# Altium schematic sheet SCH_UC.SchDoc
size A4
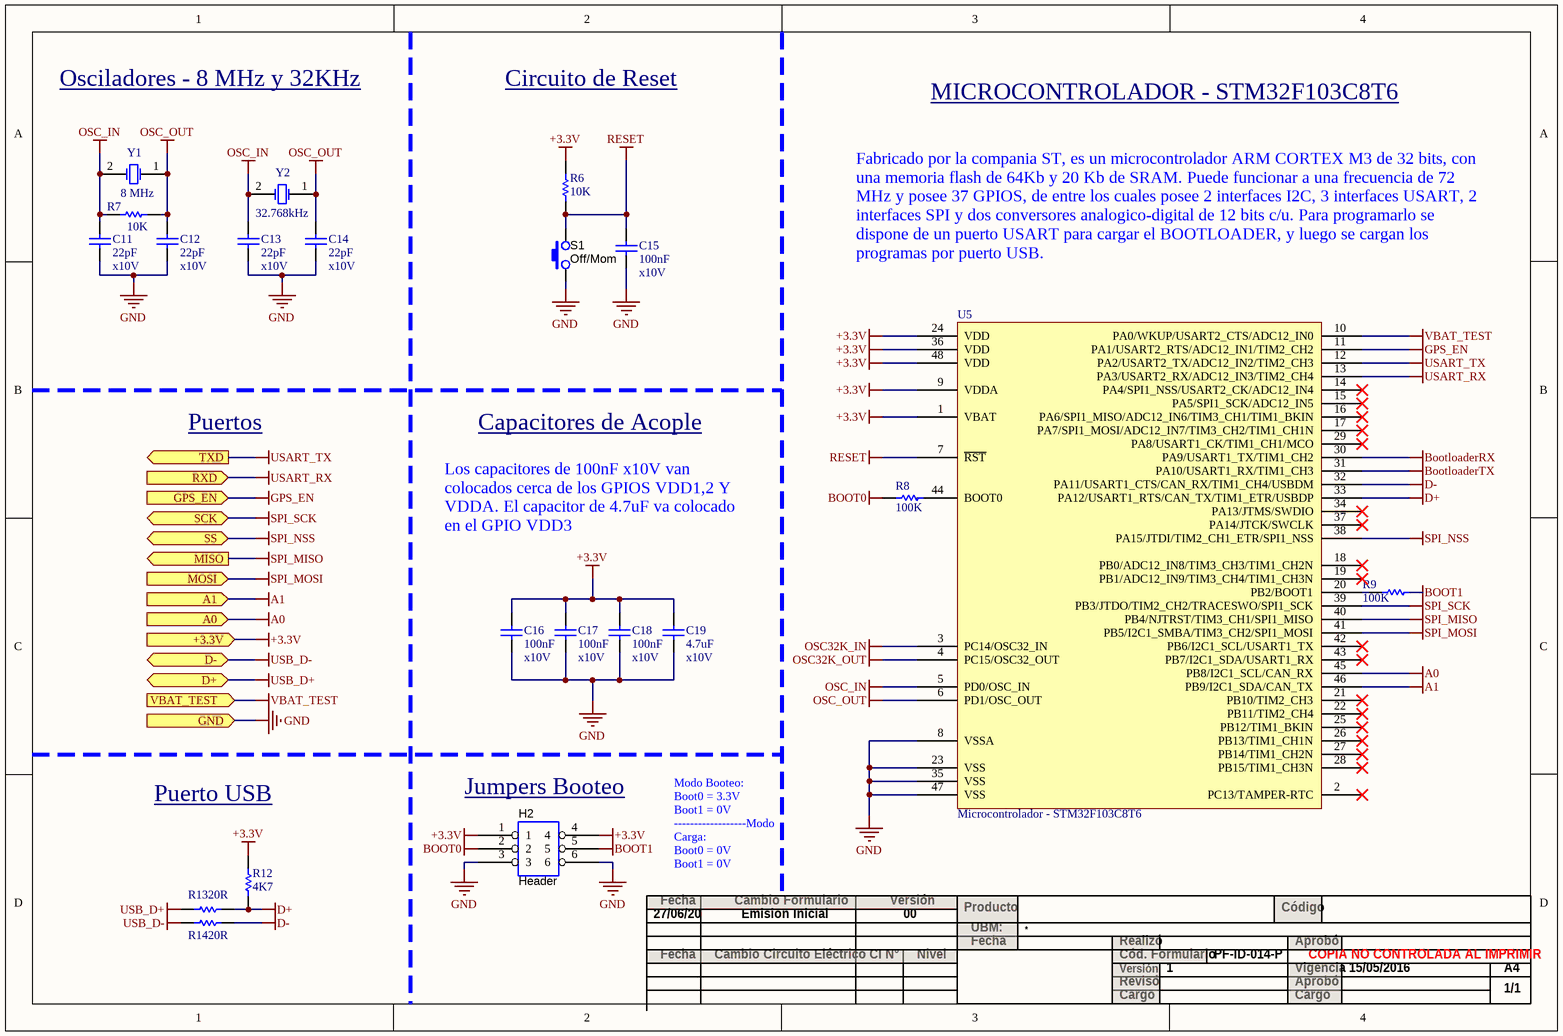
[diagram p0: SCH_UC.SchDoc]

## Parts
C11  value 22pF  Voltage: x10V  [RAD-0.3]  (hidden comment: Capacitor - Común)
C12  value 22pF  Voltage: x10V  [RAD-0.3]  (hidden comment: Capacitor - Común)
C13  value 22pF  Voltage: x10V  [RAD-0.3]  (hidden comment: Capacitor - Común)
C14  value 22pF  Voltage: x10V  [RAD-0.3]  (hidden comment: Capacitor - Común)
C15  value 100nF  Voltage: x10V  [RAD-0.3]  (hidden comment: Capacitor - Común)
C16  value 100nF  Voltage: x10V  [RAD-0.3]  (hidden comment: Capacitor - Común)
C17  value 100nF  Voltage: x10V  [RAD-0.3]  (hidden comment: Capacitor - Común)
C18  value 100nF  Voltage: x10V  [RAD-0.3]  (hidden comment: Capacitor - Común)
C19  value 4.7uF  Voltage: x10V  [RAD-0.3]  (hidden comment: Capacitor - Común)
H2  Header  [HDR_1x2_Offset]  (no BOM)
R6  value 10K  [AXIAL-0.5]  (hidden comment: Resistencia - Común)
R7  value 10K  [AXIAL-0.5]  (hidden comment: Resistencia - Común)
R8  value 100K  [AXIAL-0.5]  (hidden comment: Resistencia - Común)
R9  value 100K  [AXIAL-0.5]  (hidden comment: Resistencia - Común)
R12  value 4K7  [AXIAL-0.5]  (hidden comment: Resistencia - Común)
R13  value 20R  [AXIAL-0.5]  (hidden comment: Resistencia - Común)
R14  value 20R  [AXIAL-0.5]  (hidden comment: Resistencia - Común)
S1  Function: Off/Mom  [SWITCH_DPDT_RA_7201K2A]  (hidden comment: OFF-MOM)
U5  Microcontrolador - STM32F103C8T6
Y1  8 MHz  [R38]
Y2  32.768kHz  [R38]

## Ports
+3.3V (in), A0 (in), A1 (in), D+ (bidir), D- (bidir), GND (in), GPS_EN (in), MISO (out), MOSI (in), RXD (in), SCK (bidir), SS (bidir), TXD (out), VBAT_TEST (in)

## Nets
+3.3V: C16.2 C17.2 C18.2 C19.2 H2.1 H2.4 R6.2 R12.2 U5.1(VBAT) U5.9(VDDA) U5.24(VDD) U5.36(VDD) U5.48(VDD) ; port +3.3V
A0: U5.45(PB8/I2C1_SCL/CAN_RX) ; port A0
A1: U5.46(PB9/I2C1_SDA/CAN_TX) ; port A1
BOOT0: H2.2 R8.2
BOOT1: H2.5 R9.1
BootloaderRX: U5.30(PA9/USART1_TX/TIM1_CH2)
BootloaderTX: U5.31(PA10/USART1_RX/TIM1_CH3)
D+: R12.1 R13.1 U5.33(PA12/USART1_RTS/CAN_TX/TIM1_ETR/USBDP)
D-: R14.1 U5.32(PA11/USART1_CTS/CAN_RX/TIM1_CH4/USBDM)
GND: C11.2 C12.2 C13.2 C14.2 C15.1 C16.1 C17.1 C18.1 C19.1 H2.3 H2.6 S1.1 U5.8(VSSA) U5.23(VSS) U5.35(VSS) U5.47(VSS) ; port GND
GPS_EN: U5.11(PA1/USART2_RTS/ADC12_IN1/TIM2_CH2) ; port GPS_EN
OSC32K_IN: U5.3(PC14/OSC32_IN)
OSC32K_OUT: U5.4(PC15/OSC32_OUT)
OSC_IN: C11.1 C13.1 R7.2 U5.5(PD0/OSC_IN) Y1.2(OSC2) Y2.2(OSC2)
OSC_OUT: C12.1 C14.1 R7.1 U5.6(PD1/OSC_OUT) Y1.1(OSC1) Y2.1(OSC1)
RESET: C15.2 R6.1 S1.2 U5.7(~{RST})
SPI_MISO: U5.40(PB4/NJTRST/TIM3_CH1/SPI1_MISO) ; port MISO
SPI_MOSI: U5.41(PB5/I2C1_SMBA/TIM3_CH2/SPI1_MOSI) ; port MOSI
SPI_NSS: U5.38(PA15/JTDI/TIM2_CH1_ETR/SPI1_NSS) ; port SS
SPI_SCK: U5.39(PB3/JTDO/TIM2_CH2/TRACESWO/SPI1_SCK) ; port SCK
USART_RX: U5.13(PA3/USART2_RX/ADC12_IN3/TIM2_CH4) ; port RXD
USART_TX: U5.12(PA2/USART2_TX/ADC12_IN2/TIM2_CH3) ; port TXD
USB_D+: R13.2 ; port D+
USB_D-: R14.2 ; port D-
VBAT_TEST: U5.10(PA0/WKUP/USART2_CTS/ADC12_IN0) ; port VBAT_TEST
NetR9_2: R9.2 U5.20(PB2/BOOT1)

Not connected (* = marked no-connect by the designer): R8 1; U5 2(PC13/TAMPER-RTC)* 14(PA4/SPI1_NSS/USART2_CK/ADC12_IN4)* 15(PA5/SPI1_SCK/ADC12_IN5)* 16(PA6/SPI1_MISO/ADC12_IN6/TIM3_CH1/TIM1_BKIN)* 17(PA7/SPI1_MOSI/ADC12_IN7/TIM3_CH2/TIM1_CH1N)* 18(PB0/ADC12_IN8/TIM3_CH3/TIM1_CH2N)* 19(PB1/ADC12_IN9/TIM3_CH4/TIM1_CH3N)* 21(PB10/TIM2_CH3)* 22(PB11/TIM2_CH4)* 25(PB12/TIM1_BKIN)* 26(PB13/TIM1_CH1N)* 27(PB14/TIM1_CH2N)* 28(PB15/TIM1_CH3N)* 29(PA8/USART1_CK/TIM1_CH1/MCO)* 34(PA13/JTMS/SWDIO)* 37(PA14/JTCK/SWCLK)* 42(PB6/I2C1_SCL/USART1_TX)* 43(PB7/I2C1_SDA/USART1_RX)* 44(BOOT0)

## Notes on the sheet
- Osciladores - 8 MHz y 32KHz
- Circuito de Reset
- MICROCONTROLADOR - STM32F103C8T6
- (near U5) Fabricado por la compania ST, es un microcontrolador ARM CORTEX M3 de 32 bits, con una memoria flash de 64Kb y 20 Kb de SRAM. Puede funcionar a una frecuencia de 72 MHz y posee 37 GPIOS, de entre los cuales posee 2 interfaces I2C, 3 interfaces USART, 2 interfaces SPI y dos conversores analogico-digital de 12 bits c/u. Para programarlo se dispone de un puerto USART para cargar el BOOTLOADER, y luego se cargan los programas por puerto USB.
- Puertos
- Capacitores de Acople
- Los capacitores de 100nF x10V van colocados cerca de los GPIOS VDD1,2 Y VDDA. El capacitor de 4.7uF va colocado en el GPIO VDD3
- Puerto USB
- (near H2) Jumpers Booteo
- Modo Booteo:
  Boot0 = 3.3V
  Boot1 = 0V
  ------------------Modo Carga:
  Boot0 = 0V
  Boot1 = 0V
- 27/06/20
- Fecha
- Cambio Formulario
- Emision Inicial
- Versión
- 00
- Producto
- Código
- Cambio Circuito Eléctrico
- CI N°
- Nivel
- UBM:
- Revisó
- Cód. Formulario
- Realizó
- 1
- PF-ID-014-P
- Aprobó
- Vigencia
- COPIA NO CONTROLADA AL IMPRIMIR
- 15/05/2016
- A4
- Cargo
- 1/1

## Library data of the parts
C11-C19 = Capacitor - Común: Capacitor; Published: 8-Jun-2000; LatestRevisionDate: 17-Jul-2002; LatestRevisionNote: Re-released for DXP Platform.; PackageReference: RAD-0.3; Publisher: Altium Limited; PackageDescription: Radial Cap, Thru-Hole; 2 Leads; 0.3 in Pin Spacing
H2 = Conector - 6 Pos: Header, 6-pin
R6-R9 R12-R14 = Resistencia - Común: Semiconductor Resistor; Published: 8-Jun-2000; LatestRevisionDate: 17-Jul-2002; LatestRevisionNote: Re-released for DXP Platform.; PackageReference: AXIAL-0.5; Publisher: Altium Limited; PackageDescription: Axial Device, Thru-Hole; 2 Leads; 0.5 in Pin Spacing
S1 = Conector - Switch: Switch wire leads momentary SPST; Manufacturer 1: Judco Manufacturing Inc; Manufacturer Part Number 1: 40-2390-00; SCDType: spec; Package / Case: Panel-mount with wire leads; Supplier 1: Digi-Key; Supplier Part Number 1: 506PB-ND
U5 = Microcontrolador - STM32F103C8T6: ARM Cortex-M3 MCU with 64 Kbytes Flash, 72 MHz CPU
Y1 Y2 = Cristal Oscilador: Crystal Oscillator; Published: 8-Jun-2000; LatestRevisionDate: 17-Jul-2002; LatestRevisionNote: Re-released for DXP Platform.; PackageReference: R38; Publisher: Altium Limited; PackageDescription: Crystal, Thru-Hole; 2 Leads; Body 3.1 x 8.2 mm (Dia.xH)